# Altium schematic sheet LoRa.SchDoc
size A; SheetNumber: 2; SheetTotal: 4
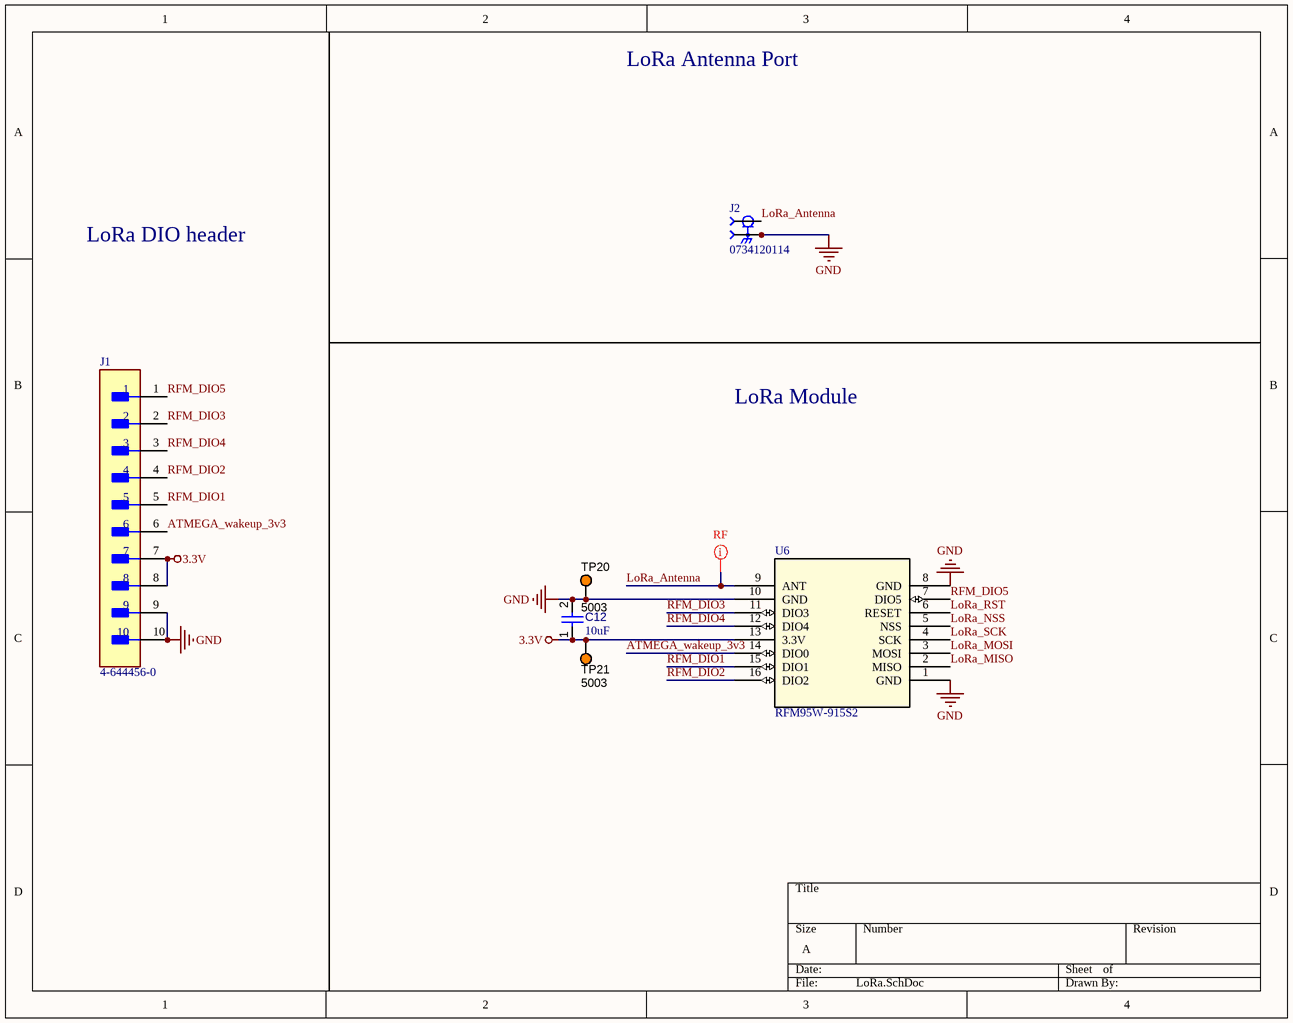
[diagram p0: LoRa.SchDoc]

## Parts
C12  value 10uF  [CAPC1608X90X40NL10T20]  (hidden comment: Capacitor 100 nF +/-10% 50 V 0603)
J1  4-644456-0  [FP-4-644456-0-MFG]
J2  0734120114  [MOLEX_0734120114]
TP20  5003  [KSTN-5003]
TP21  5003  [KSTN-5003]
U6  RFM95W-915S2  [IC16_RFM95W-915S2_RFS]

## Nets
3.3V: C12.1 J1.7 J1.8 TP21.1 U6.13(3.3V)
GND: C12.2 J1.9 J1.10 J2.2(GND) J2.3(GND) J2.4(GND) TP20.1 U6.1(GND) U6.8(GND) U6.10(GND)
ATMEGA_wakeup_3v3: J1.6 U6.14(DIO0)
LoRa_Antenna: J2.1(SIG) U6.9(ANT)
LoRa_MISO: U6.2(MISO)
LoRa_MOSI: U6.3(MOSI)
LoRa_NSS: U6.5(NSS)
LoRa_RST: U6.6(RESET)
LoRa_SCK: U6.4(SCK)
RFM_DIO1: J1.5 U6.15(DIO1)
RFM_DIO2: J1.4 U6.16(DIO2)
RFM_DIO3: J1.2 U6.11(DIO3)
RFM_DIO4: J1.3 U6.12(DIO4)
RFM_DIO5: J1.1 U6.7(DIO5)

## Layout directives
net class RF: LoRa_Antenna

## Notes on the sheet
- LoRa Antenna Port
- LoRa DIO header
- LoRa Module

## Library data of the parts
C12 = CMP-001-00017-6: Chip Capacitor, 100 nF, +/- 10%, 50 V, 0603 (1608 Metric); Voltage Rating: 50V; Capacitor Type: Ceramic; Tolerance: 10%; Mounting Technology: SM; Max Operating Temperature: 125°C; RoHS Compliant: True; Pins: 2; Case/Package: 0603; Min Operating Temperature: -55°C
J1 = CMP-002-00072-1: Board Connector, 10 Contact(s), 1 Row(s), Male, Straight, 0.1 inch Pitch, Solder Terminal, Natural Insulator, Plug; Min Operating Temperature: -55°C; RoHS Compliant: Yes; Mounting Technology: Board; Max Operating Temperature: 105°C; Connector Type: BOARD CONNECTOR
J2 = CMP-003-000000-1: U.FL (UMCC) Connector Receptacle, Male Pin 50Ohm Surface Mount Solder; MF: Molex; Value: *; Price: None; Source: 0734120114.SchLib; Component Type: Standard; Pin Count: 4; SnapEDA_Link: https://www.snapeda.com/parts/0734120114/Molex/view-part/557843/?ref=snap; Package: None; Availability: Unavailable; MP: 0734120114; Design Item ID: 0734120114
TP20 TP21 = CMP-002-00037-2: Test Point, Orange, Height 4.6 mm, Tail Length 3 mm, 1-Pin THD, RoHS; Manufacturer: Keystone; Colour: Orange; Packaging: Bulk; Package Description: 1-Pin Through Hole Device, Dia 2.54 mm; Pins: 1; Package Reference: 5003; Datasheet Version: Jun-15; Case/Package: 5003; Mounting Technology: TH; Connector Type: TestPoint; Diameter: 2.54mm; Contact Material: Bronze; Datasheet URL: http://keyelco.com/userAssets/file/M65p56.pdf; Manufacturer URL: http://www.keyelco.com/; Package Quantity: 10; Contact Plating: Tin; RoHS Compliant: True
U6 = CMP-00025-00004-1: No Description Available; Mfr_Name: RF Solutions; Copyright: Copyright (C) 2023 Ultra Librarian. All rights reserved.; RefDes: RefDes; Source: RFM95W-915S2.SchLib; Type: DEV; Manufacturer_Part_Number: RFM95W-915S2; Design Item ID: RFM95W-915S2